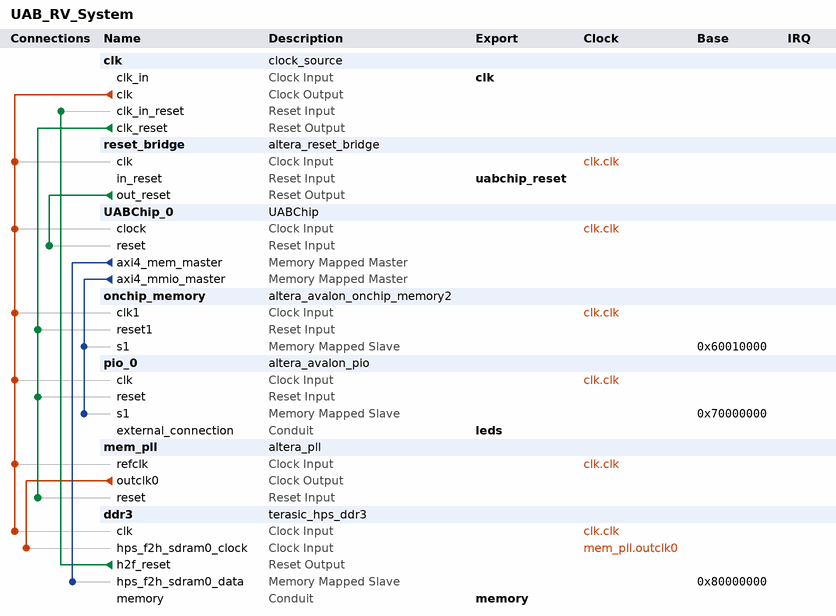
[diagram p0: system contents]
# Platform Designer (Qsys) system UAB_RV_System, Cyclone V 5CSEBA6U23I7
# Parameters at their usual value, and those the tool derives, are not listed.
package require -exact qsys 20.1
create_system UAB_RV_System
set_project_property DEVICE_FAMILY {Cyclone V}
set_project_property DEVICE 5CSEBA6U23I7

add_instance clk clock_source 20.1
set_instance_parameter_value clk clockFrequency 50000000

add_instance reset_bridge altera_reset_bridge 20.1
set_instance_parameter_value reset_bridge ACTIVE_LOW_RESET 0
set_instance_parameter_value reset_bridge SYNCHRONOUS_EDGES deassert

add_instance UABChip_0 UABChip 1.0

add_instance onchip_memory altera_avalon_onchip_memory2 20.1
set_instance_parameter_value onchip_memory allowInSystemMemoryContentEditor true
set_instance_parameter_value onchip_memory dataWidth 64
set_instance_parameter_value onchip_memory dualPort false
set_instance_parameter_value onchip_memory initMemContent true
set_instance_parameter_value onchip_memory initializationFileName /home/oscar/UAB-RV/onchip_memory.mif
set_instance_parameter_value onchip_memory instanceID BRAM
set_instance_parameter_value onchip_memory memorySize 65536
set_instance_parameter_value onchip_memory useNonDefaultInitFile true

add_instance pio_0 altera_avalon_pio 20.1
set_instance_parameter_value pio_0 direction Output
set_instance_parameter_value pio_0 width 8

add_instance mem_pll altera_pll 20.1
set_instance_parameter_value mem_pll gui_device_speed_grade 1
set_instance_parameter_value mem_pll gui_number_of_clocks 1
set_instance_parameter_value mem_pll gui_operation_mode direct
set_instance_parameter_value mem_pll gui_output_clock_frequency0 100.0
set_instance_parameter_value mem_pll gui_pll_mode {Integer-N PLL}
set_instance_parameter_value mem_pll gui_reference_clock_frequency 100.0
set_instance_parameter_value mem_pll gui_use_locked false

add_instance ddr3 terasic_hps_ddr3 1.0

# connections
add_connection clk.clk ddr3.clk clock
add_connection clk.clk mem_pll.refclk clock
add_connection clk.clk onchip_memory.clk1 clock
add_connection clk.clk pio_0.clk clock
add_connection clk.clk reset_bridge.clk clock
add_connection clk.clk UABChip_0.clock clock
add_connection mem_pll.outclk0 ddr3.hps_f2h_sdram0_clock clock
add_connection clk.clk_reset mem_pll.reset reset
add_connection clk.clk_reset onchip_memory.reset1 reset
add_connection clk.clk_reset pio_0.reset reset
add_connection ddr3.h2f_reset clk.clk_in_reset reset
add_connection reset_bridge.out_reset UABChip_0.reset reset
add_connection UABChip_0.axi4_mem_master ddr3.hps_f2h_sdram0_data avalon
set_connection_parameter_value UABChip_0.axi4_mem_master/ddr3.hps_f2h_sdram0_data baseAddress 0x80000000
add_connection UABChip_0.axi4_mmio_master onchip_memory.s1 avalon
set_connection_parameter_value UABChip_0.axi4_mmio_master/onchip_memory.s1 baseAddress 0x60010000
add_connection UABChip_0.axi4_mmio_master pio_0.s1 avalon
set_connection_parameter_value UABChip_0.axi4_mmio_master/pio_0.s1 baseAddress 0x70000000

# exported interfaces
add_interface clk clock sink
set_interface_property clk EXPORT_OF clk.clk_in
add_interface leds conduit end
set_interface_property leds EXPORT_OF pio_0.external_connection
add_interface memory conduit end
set_interface_property memory EXPORT_OF ddr3.memory
add_interface uabchip_reset reset sink
set_interface_property uabchip_reset EXPORT_OF reset_bridge.in_reset

set_interconnect_requirement {$system} qsys_mm.clockCrossingAdapter HANDSHAKE
set_interconnect_requirement {$system} qsys_mm.enableEccProtection FALSE
set_interconnect_requirement {$system} qsys_mm.insertDefaultSlave FALSE
set_interconnect_requirement {$system} qsys_mm.maxAdditionalLatency 1

save_system UAB_RV_System.qsys
